# Altium schematic sheet RS485_SPI_Recieve.SchDoc
size A4 portrait
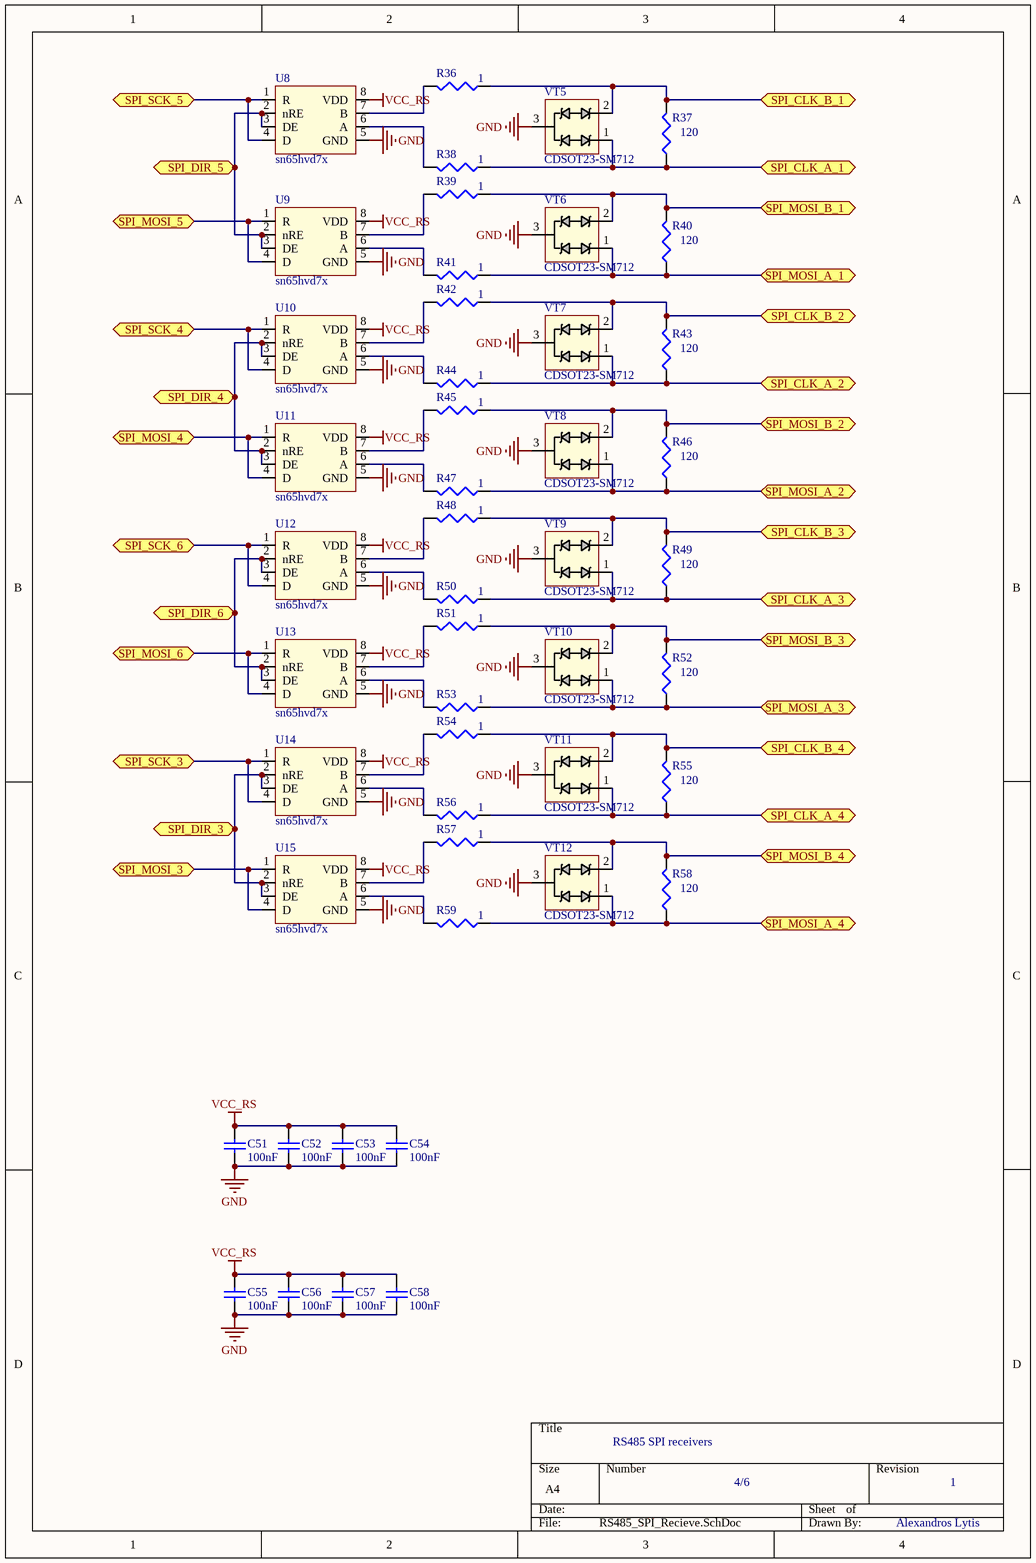
[diagram p0: RS485_SPI_Recieve.SchDoc]

## Parts
C51  value 100nF  [CAP0603]  (hidden comment: Cap Semi)
C52  value 100nF  [CAP0603]  (hidden comment: Cap Semi)
C53  value 100nF  [CAP0603]  (hidden comment: Cap Semi)
C54  value 100nF  [CAP0603]  (hidden comment: Cap Semi)
C55  value 100nF  [CAP0603]  (hidden comment: Cap Semi)
C56  value 100nF  [CAP0603]  (hidden comment: Cap Semi)
C57  value 100nF  [CAP0603]  (hidden comment: Cap Semi)
C58  value 100nF  [CAP0603]  (hidden comment: Cap Semi)
R36  value 1  [RES0603]  (hidden comment: p-p)
R37  value 120  [RES0603]  (hidden comment: pp)
R38  value 1  [RES0603]  (hidden comment: p-p)
R39  value 1  [RES0603]  (hidden comment: p-p)
R40  value 120  [RES0603]  (hidden comment: pp)
R41  value 1  [RES0603]  (hidden comment: p-p)
R42  value 1  [RES0603]  (hidden comment: p-p)
R43  value 120  [RES0603]  (hidden comment: pp)
R44  value 1  [RES0603]  (hidden comment: p-p)
R45  value 1  [RES0603]  (hidden comment: p-p)
R46  value 120  [RES0603]  (hidden comment: pp)
R47  value 1  [RES0603]  (hidden comment: p-p)
R48  value 1  [RES0603]  (hidden comment: p-p)
R49  value 120  [RES0603]  (hidden comment: pp)
R50  value 1  [RES0603]  (hidden comment: p-p)
R51  value 1  [RES0603]  (hidden comment: p-p)
R52  value 120  [RES0603]  (hidden comment: pp)
R53  value 1  [RES0603]  (hidden comment: p-p)
R54  value 1  [RES0603]  (hidden comment: p-p)
R55  value 120  [RES0603]  (hidden comment: pp)
R56  value 1  [RES0603]  (hidden comment: p-p)
R57  value 1  [RES0603]  (hidden comment: p-p)
R58  value 120  [RES0603]  (hidden comment: pp)
R59  value 1  [RES0603]  (hidden comment: p-p)
U8  sn65hvd7x  [SOP127P600-8N]
U9  sn65hvd7x  [SOP127P600-8N]
U10  sn65hvd7x  [SOP127P600-8N]
U11  sn65hvd7x  [SOP127P600-8N]
U12  sn65hvd7x  [SOP127P600-8N]
U13  sn65hvd7x  [SOP127P600-8N]
U14  sn65hvd7x  [SOP127P600-8N]
U15  sn65hvd7x  [SOP127P600-8N]
VT5  CDSOT23-SM712  [SOT190P230X117-3N]
VT6  CDSOT23-SM712  [SOT190P230X117-3N]
VT7  CDSOT23-SM712  [SOT190P230X117-3N]
VT8  CDSOT23-SM712  [SOT190P230X117-3N]
VT9  CDSOT23-SM712  [SOT190P230X117-3N]
VT10  CDSOT23-SM712  [SOT190P230X117-3N]
VT11  CDSOT23-SM712  [SOT190P230X117-3N]
VT12  CDSOT23-SM712  [SOT190P230X117-3N]

## Ports
SPI_CLK_A_1, SPI_CLK_A_2, SPI_CLK_A_3, SPI_CLK_A_4, SPI_CLK_B_1, SPI_CLK_B_2, SPI_CLK_B_3, SPI_CLK_B_4, SPI_DIR_3, SPI_DIR_4, SPI_DIR_5, SPI_DIR_6, SPI_MOSI_3, SPI_MOSI_4, SPI_MOSI_5, SPI_MOSI_6, SPI_MOSI_A_1, SPI_MOSI_A_2, SPI_MOSI_A_3, SPI_MOSI_A_4, SPI_MOSI_B_1, SPI_MOSI_B_2, SPI_MOSI_B_3, SPI_MOSI_B_4, SPI_SCK_3, SPI_SCK_4, SPI_SCK_5, SPI_SCK_6

## Nets
GND: C51.1 C52.1 C53.1 C54.1 C55.1 C56.1 C57.1 C58.1 U8.5(GND) U9.5(GND) U10.5(GND) U11.5(GND) U12.5(GND) U13.5(GND) U14.5(GND) U15.5(GND) VT5.3 VT6.3 VT7.3 VT8.3 VT9.3 VT10.3 VT11.3 VT12.3
VCC_RS: C51.2 C52.2 C53.2 C54.2 C55.2 C56.2 C57.2 C58.2 U8.8(VDD) U9.8(VDD) U10.8(VDD) U11.8(VDD) U12.8(VDD) U13.8(VDD) U14.8(VDD) U15.8(VDD)
SPI_CLK_A_1: R37.1 R38.1 VT5.1 ; port SPI_CLK_A_1
SPI_CLK_A_2: R43.1 R44.1 VT7.1 ; port SPI_CLK_A_2
SPI_CLK_A_3: R49.1 R50.1 VT9.1 ; port SPI_CLK_A_3
SPI_CLK_A_4: R55.1 R56.1 VT11.1 ; port SPI_CLK_A_4
SPI_CLK_B_1: R36.1 R37.2 VT5.2 ; port SPI_CLK_B_1
SPI_CLK_B_2: R42.1 R43.2 VT7.2 ; port SPI_CLK_B_2
SPI_CLK_B_3: R48.1 R49.2 VT9.2 ; port SPI_CLK_B_3
SPI_CLK_B_4: R54.1 R55.2 VT11.2 ; port SPI_CLK_B_4
SPI_DIR_3: U14.2(nRE) U14.3(DE) U15.2(nRE) U15.3(DE) ; port SPI_DIR_3
SPI_DIR_4: U10.2(nRE) U10.3(DE) U11.2(nRE) U11.3(DE) ; port SPI_DIR_4
SPI_DIR_5: U8.2(nRE) U8.3(DE) U9.2(nRE) U9.3(DE) ; port SPI_DIR_5
SPI_DIR_6: U12.2(nRE) U12.3(DE) U13.2(nRE) U13.3(DE) ; port SPI_DIR_6
SPI_MOSI_3: U15.1(R) U15.4(D) ; port SPI_MOSI_3
SPI_MOSI_4: U11.1(R) U11.4(D) ; port SPI_MOSI_4
SPI_MOSI_5: U9.1(R) U9.4(D) ; port SPI_MOSI_5
SPI_MOSI_6: U13.1(R) U13.4(D) ; port SPI_MOSI_6
SPI_MOSI_A_1: R40.1 R41.1 VT6.1 ; port SPI_MOSI_A_1
SPI_MOSI_A_2: R46.1 R47.1 VT8.1 ; port SPI_MOSI_A_2
SPI_MOSI_A_3: R52.1 R53.1 VT10.1 ; port SPI_MOSI_A_3
SPI_MOSI_A_4: R58.1 R59.1 VT12.1 ; port SPI_MOSI_A_4
SPI_MOSI_B_1: R39.1 R40.2 VT6.2 ; port SPI_MOSI_B_1
SPI_MOSI_B_2: R45.1 R46.2 VT8.2 ; port SPI_MOSI_B_2
SPI_MOSI_B_3: R51.1 R52.2 VT10.2 ; port SPI_MOSI_B_3
SPI_MOSI_B_4: R57.1 R58.2 VT12.2 ; port SPI_MOSI_B_4
SPI_SCK_3: U14.1(R) U14.4(D) ; port SPI_SCK_3
SPI_SCK_4: U10.1(R) U10.4(D) ; port SPI_SCK_4
SPI_SCK_5: U8.1(R) U8.4(D) ; port SPI_SCK_5
SPI_SCK_6: U12.1(R) U12.4(D) ; port SPI_SCK_6
NetR36_2: R36.2 U8.7(B)
NetR38_2: R38.2 U8.6(A)
NetR39_2: R39.2 U9.7(B)
NetR41_2: R41.2 U9.6(A)
NetR42_2: R42.2 U10.7(B)
NetR44_2: R44.2 U10.6(A)
NetR45_2: R45.2 U11.7(B)
NetR47_2: R47.2 U11.6(A)
NetR48_2: R48.2 U12.7(B)
NetR50_2: R50.2 U12.6(A)
NetR51_2: R51.2 U13.7(B)
NetR53_2: R53.2 U13.6(A)
NetR54_2: R54.2 U14.7(B)
NetR56_2: R56.2 U14.6(A)
NetR57_2: R57.2 U15.7(B)
NetR59_2: R59.2 U15.6(A)

## Notes on the sheet
- RS485 SPI receivers
- 4/6
- 1
- Alexandros Lytis

## Library data of the parts
C51-C58 = Cap Semi: Capacitor (Semiconductor SIM Model); Published: 8-Jun-2000; LatestRevisionDate: 29-May-2009; LatestRevisionNote: IPC-7351 Footprint Added.; PackageReference: C1206; Publisher: Altium Limited; PackageDescription: Chip Capacitor
R36-R59 = Res3: Resistor; Published: 8-Jun-2000; LatestRevisionDate: 29-May-2009; LatestRevisionNote: IPC-7351 Footprint Added.; PackageReference: J1-0603; Publisher: Altium Limited; PackageDescription: Chip Resistor